# Altium schematic sheet Circuit.SchDoc
size A4
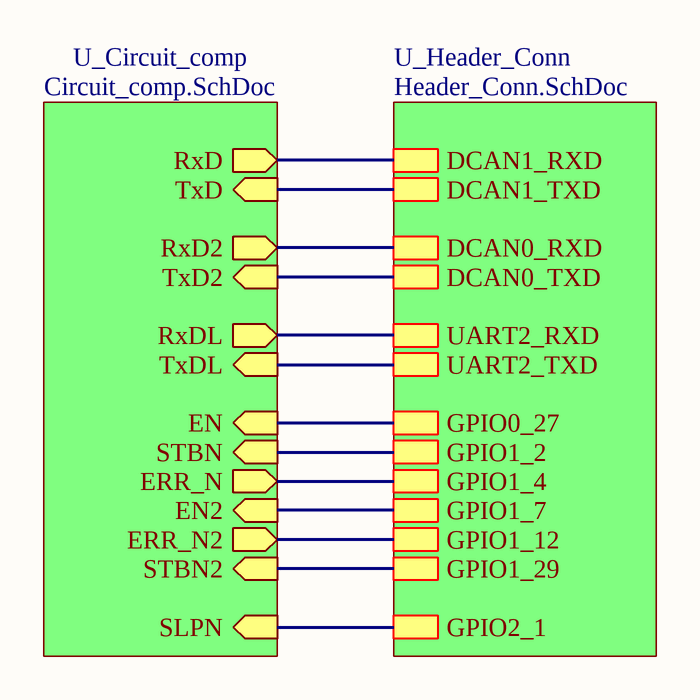
[diagram p0: Circuit.SchDoc]

## Sub-sheets
U_Circuit_comp = Circuit_comp.SchDoc: STBN2 (in), EN2 (in), TxD2 (in), ERR_N2 (out), RxD2 (out), RxDL (out), TxDL (in), SLPN (in), ERR_N (out), RxD (out), STBN (in), EN (in), TxD (in)
U_Header_Conn = Header_Conn.SchDoc: GPIO1_2, GPIO0_27, GPIO1_7, GPIO1_12, GPIO1_29, DCAN0_RXD, UART2_TXD, DCAN0_TXD, UART2_RXD, DCAN1_RXD, DCAN1_TXD, GPIO1_4, GPIO2_1

## Nets
(unnamed): sheet U_Circuit_comp/STBN2, sheet U_Header_Conn/GPIO1_29
(unnamed): sheet U_Circuit_comp/EN2, sheet U_Header_Conn/GPIO1_7
(unnamed): sheet U_Circuit_comp/TxD2, sheet U_Header_Conn/DCAN0_TXD
(unnamed): sheet U_Circuit_comp/ERR_N2, sheet U_Header_Conn/GPIO1_12
(unnamed): sheet U_Circuit_comp/RxD2, sheet U_Header_Conn/DCAN0_RXD
(unnamed): sheet U_Circuit_comp/RxDL, sheet U_Header_Conn/UART2_RXD
(unnamed): sheet U_Circuit_comp/TxDL, sheet U_Header_Conn/UART2_TXD
(unnamed): sheet U_Circuit_comp/SLPN, sheet U_Header_Conn/GPIO2_1
(unnamed): sheet U_Circuit_comp/ERR_N, sheet U_Header_Conn/GPIO1_4
(unnamed): sheet U_Circuit_comp/RxD, sheet U_Header_Conn/DCAN1_RXD
(unnamed): sheet U_Circuit_comp/STBN, sheet U_Header_Conn/GPIO1_2
(unnamed): sheet U_Circuit_comp/EN, sheet U_Header_Conn/GPIO0_27
(unnamed): sheet U_Circuit_comp/TxD, sheet U_Header_Conn/DCAN1_TXD